# Altium project TMC2590_BOB40_V1_0.PrjPcb
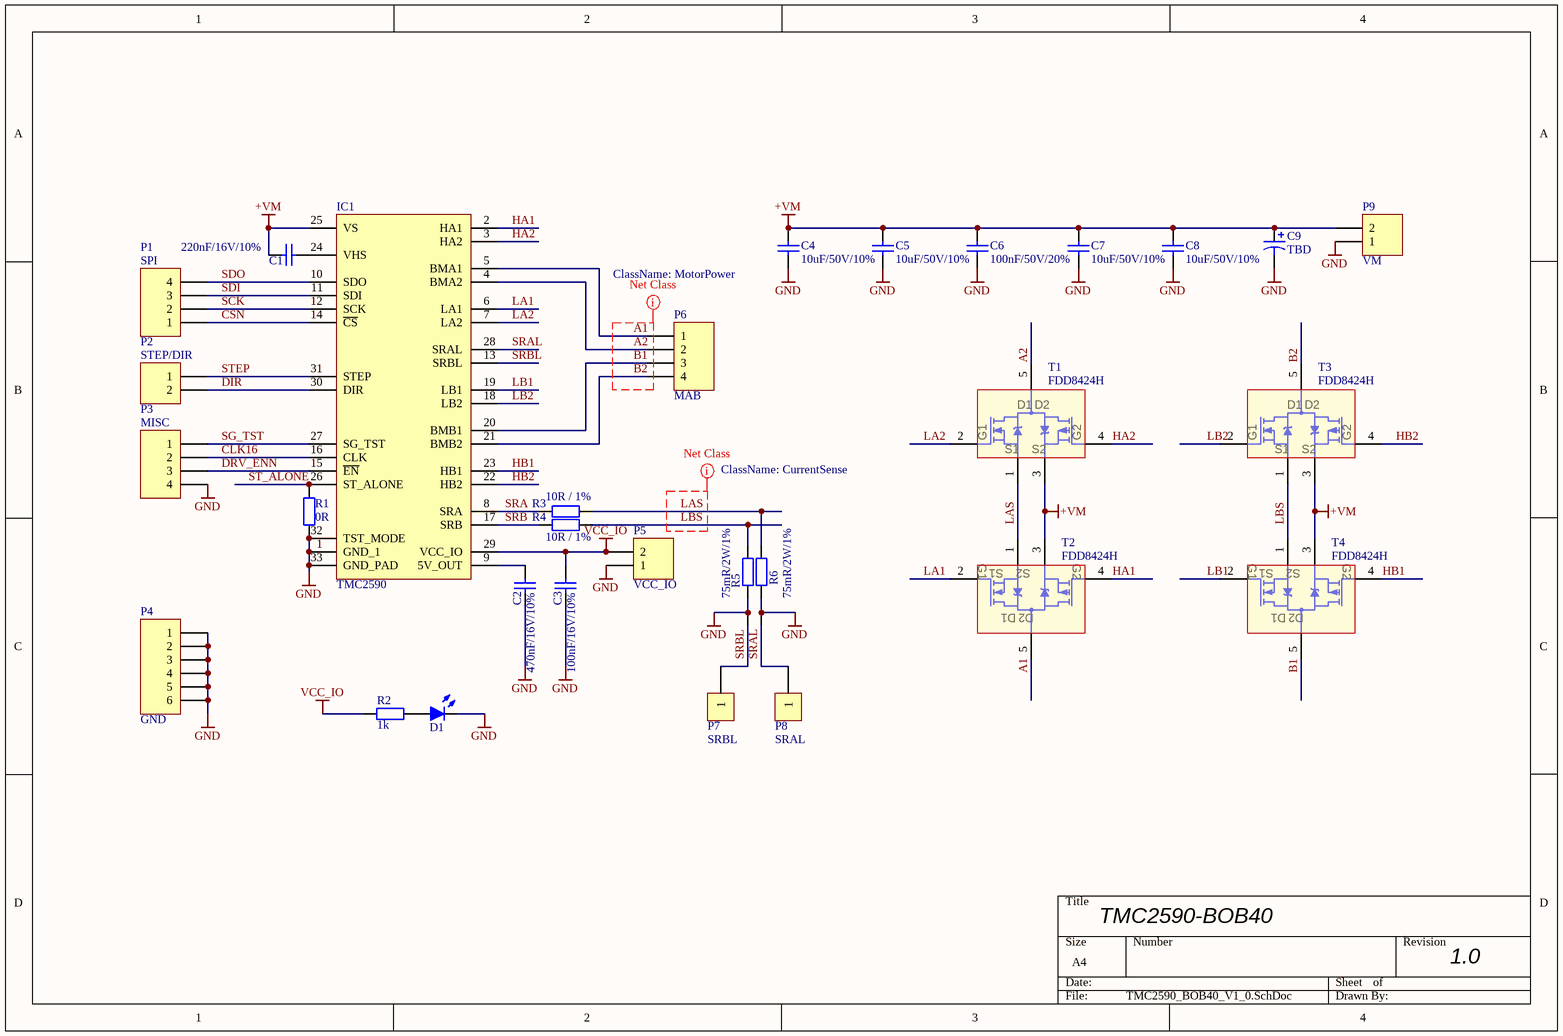
[diagram p0: TMC2590_BOB40_V1_0.SchDoc]
BoardName: TMC2590-BOB40; BoardVersion: 1.0; Chip: TMC2590; IRMS: 2.8A; VS: 9...40V
2 sheets, 32 parts. Net scope: global (net labels, ports and power ports of the same name join across sheets).
Board file: TMC2590_BOB40_V1_0.PcbDoc
Sheets:
  TMC2590_BOB40_V1_0.SchDoc
  ChangeLog.SchDoc

## Sheet TMC2590_BOB40_V1_0.SchDoc
size A4; DocumentNumber: 1; SheetNumber: 1; SheetTotal: 2

### Parts
C1  220nF/16V/10%  [C0603]
C2  470nF/16V/10%  [C0603]
C3  100nF/16V/10%  [C0603]
C4  10uF/50V/10%  [C1206]
C5  10uF/50V/10%  [C1206]
C6  100nF/50V/20%  [C0603]
C7  10uF/50V/10%  [C1206]
C8  10uF/50V/10%  [C1206]
C9  value TBD  [EXT_POL_CAP]  (hidden comment: Cap Pol1)
D1  LED, Blue, SMD, 20mA, 2.8V, 465 nm  [LED_0603]  (value not drawn)
IC1  TMC2590  [TMC2590_QFP127P600-8N]
J1  Net tie  [Net tie 10x20mil]  (value not drawn)  (net tie, no BOM)
J2  Net tie  [Net tie 10x20mil]  (value not drawn)  (net tie, no BOM)
P1  SPI  [4_PIN_THT]
P2  STEP/DIR  [2_PIN_THT]
P3  MISC  [4_PIN_THT]
P4  GND  [6_PIN_THT]
P5  VCC_IO  [2_PIN_THT]
P6  MAB  [4_PIN_THT_1mm_hole]
P7  SRBL  [TH_PIN - NO SILK]
P8  SRAL  [TH_PIN - NO SILK]
P9  VM  [2_PIN_THT]
R1  0R  [R0603]
R2  1k  [R0603]
R3  10R / 1%  [R0603]
R4  10R / 1%  [R0603]
R5  75mR/2W/1%  [R2512]
R6  75mR/2W/1%  [R2512]
T1  FDD8424H  [SOT114P991X239-6N]
T2  FDD8424H  [SOT114P991X239-6N]
T3  FDD8424H  [SOT114P991X239-6N]
T4  FDD8424H  [SOT114P991X239-6N]

### Nets
+VM: C1.2 C4.2 C5.2 C6.2 C7.2 C8.2 C9.1 IC1.25(VS) P9.2 T1.3(S2) T2.3(S2) T3.3(S2) T4.3(S2)
GND: C2.2 C3.2 C4.1 C5.1 C6.1 C7.1 C8.1 C9.2 D1.2(K) IC1.1(GND_1) IC1.32(TST_MODE) IC1.33(GND_PAD) J1.2 J2.2 P3.4 P4.1 P4.2 P4.3 P4.4 P4.5 P4.6 P5.1 P9.1 R1.2 R5.1 R6.1
VCC_IO: C3.1 IC1.29(VCC_IO) P5.2 R2.1
A1: IC1.5(BMA1) P6.1 T2.5(D1/D2)
A2: IC1.4(BMA2) P6.2 T1.5(D1/D2)
B1: IC1.20(BMB1) P6.3 T4.5(D1/D2)
B2: IC1.21(BMB2) P6.4 T3.5(D1/D2)
CLK16: IC1.16(CLK) P3.2
CSN: IC1.14(~{CS}) P1.1
DIR: IC1.30(DIR) P2.2
DRV_ENN: IC1.15(~{EN}) P3.3
HA1: IC1.2(HA1) T2.4(G2)
HA2: IC1.3(HA2) T1.4(G2)
HB1: IC1.23(HB1) T4.4(G2)
HB2: IC1.22(HB2) T3.4(G2)
LA1: IC1.6(LA1) T2.2(G1)
LA2: IC1.7(LA2) T1.2(G1)
LAS: R3.1 R6.2 T1.1(S1) T2.1(S1)
LB1: IC1.19(LB1) T4.2(G1)
LB2: IC1.18(LB2) T3.2(G1)
LBS: R4.1 R5.2 T3.1(S1) T4.1(S1)
SCK: IC1.12(SCK) P1.2
SDI: IC1.11(SDI) P1.3
SDO: IC1.10(SDO) P1.4
SG_TST: IC1.27(SG_TST) P3.1
SRA: IC1.8(SRA) R3.2
SRAL: IC1.28(SRAL) J2.1 P8.1
SRB: IC1.17(SRB) R4.2
SRBL: IC1.13(SRBL) J1.1 P7.1
ST_ALONE: IC1.26(ST_ALONE) R1.1
STEP: IC1.31(STEP) P2.1
NetC1_1: C1.1 IC1.24(VHS)
NetC2_1: C2.1 IC1.9(5V_OUT)
NetD1_1: D1.1(A) R2.2

### Layout directives
net class CurrentSense: LAS, LBS
net class MotorPower: A1, A2, B1, B2

### Notes on the sheet
- Title
- Size:
- Date:
- File:
- A0
- Number:
- Time:
- Revision:
- Sheet
- of
- (in symbol FDD8424H) D1; D2

### Library data of the parts
C1 = Capacitor: Ceramic capacitor; MPN: MC0603B224K160CT; Type: MLCC; VoltageRating: 16V; ComponentLinknDescription: Datasheet; MF: Multicomp; Capacitance: 220nF; Precision: 10%; Characteristic: *; ComponentLinknURL: *
C2 = Capacitor: Ceramic capacitor; MPN: MC0603X474K160CT; Type: MLCC; VoltageRating: 16V; ComponentLinknDescription: Datasheet; MF: Multicomp; Capacitance: 470nF; Precision: 10%; Characteristic: *; ComponentLinknURL: *
C3 = Capacitor: Ceramic capacitor; MPN: MC0603B104K160CT; Type: MLCC; VoltageRating: 16V; ComponentLinknDescription: Datasheet; MF: Multicomp; Capacitance: 100nF; Precision: 10%; Characteristic: *; ComponentLinknURL: *
C4 C5 C7 C8 = 10 µF, 50 V, ± 10%, X5R, 1206 [3216 Metric]: SMD Multilayer Ceramic Capacitor, 1206 [3216 Metric],10 µF, 50 V, ± 10%, X5R, GRM Series; MPN: GRM31CR61H106KA12L; Type: MLCC; VoltageRating: 50V; ComponentLinknDescription: Datasheet; MF: MURATA; Capacitance: 10uF; Characteristic: *; ComponentLinknURL: *; Precision: 10%
C6 = Capacitor: Ceramic capacitor; MPN: MC0603F104M500CT; Type: MLCC; VoltageRating: 50V; ComponentLinknDescription: Datasheet; MF: Multicomp; Capacitance: 100nF; Precision: 20%; Characteristic: *; ComponentLinknURL: *
C9 = Cap Pol1: Polarized Capacitor (Radial); Fitted: Not fitted; Published: 8-Jun-2000; LatestRevisionDate: 17-Jul-2002; LatestRevisionNote: Re-released for DXP Platform.; PackageReference: RB7.6-15; Publisher: Altium Limited; PackageDescription: Polarized Capacitor (Radial); 2 Leads
D1 = LED, Blue, SMD, 20mA, 2.8V, 465 nm: MPN: LTST-C191TBKT-5A; MF: Lite-On; Current rating: 20mA; Colour: Blue
IC1 = TMC2590: Energy saving high resolution microstepping two phase stepper driver with Step/Dir, SPI, up to 60V, TQFP32(5x5); MF: TRINAMIC; MPN: TMC2590
J1 J2 = NET_TIE
P1 P3 = Header 4: Header, 4-Pin; Fitted: Not fitted; LatestRevisionDate: 17-Jul-2002; LatestRevisionNote: Re-released for DXP Platform.; Publisher: Altium Limited; ComponentClass: Pinheader
P2 P5 P9 = Header 2: Header, 2-Pin; Fitted: Not fitted; LatestRevisionDate: 17-Jul-2002; LatestRevisionNote: Re-released for DXP Platform.; Publisher: Altium Limited; ComponentClass: Pinheader
P4 = Header 6: Header, 6-Pin; Fitted: Not fitted; LatestRevisionDate: 17-Jul-2002; LatestRevisionNote: Re-released for DXP Platform.; Publisher: Altium Limited
P6 = Wire-To-Board Connector, 2.5 mm, 4 Contacts, Header, EH Series, Through Hole, 1 Rows: MPN: B4B-EH-A; MF: JST (JAPAN SOLDERLESS TERMINALS); Fitted: Not fitted
P7 P8 = PIN: Note: n.b; Fitted: Not fitted; ComponentClass: Pinheader
R1 = R, 0 ohm, 0603 [1608 Metric], 100 mW, MCWR Series: SMD Chip Resistor, Thick Film, 0 ohm, 0603 [1608 Metric], 100 mW, MCWR Series; MPN: MCWR06X000 PTL; Temp coefficient: *ppm; PowerRating: 100mW; MF: MULTICOMP; Resistance: 0R
R2 = 1 kohm, 50 V, 0603 [1608 Metric], 63 mW, ± 1%, MC Series: MPN: MC0063W060311K; VoltageRating: 50V; Temp coefficient: *ppm; PowerRating: 63mW; MF: MULTICOMP; Precision: 1%; Manufacturer: *; ComponentLinknURL: *; Resistance: 1k
R3 R4 = .05 OHM 2W 1% Current Sense Resistor: SMD Chip Resistor, Thick Film, 10 ohm, 50 V, 0603 [1608 Metric], 100 mW, ± 1%, MCWR Series; MPN: MCWR06X10R0FTL; PowerRating: 100mW; ComponentLinknDescription: Datasheet; MF: Multicomp; Precision: 1%; Manufacturer: *; ComponentLinknURL: *; Resistance: 10R
R5 R6 = .075 OHM 2W 1% Current Sense Resistor: SMD Current Sense Resistor, 0.075 ohm, 2 W, 2512 [6432 Metric], ± 1%, TLR Series; MPN: TLR3A20WR075FTDG; PowerRating: 2W; ComponentLinknDescription: Datasheet; MF: TE CONNECTIVITY; Resistance: 75mR; Precision: 1%; Manufacturer: *; ComponentLinknURL: *
T1-T4 = FDD8424H: Dual MOSFET, N and P Channel, 9 A, 40 V, 0.019 ohm, 10 V, 1.7 V; MF: FAIRCHILD SEMICONDUCTOR; MPN: FDD8424H

## Sheet ChangeLog.SchDoc
size A4; DocumentNumber: 2; SheetNumber: 2; SheetTotal: 2
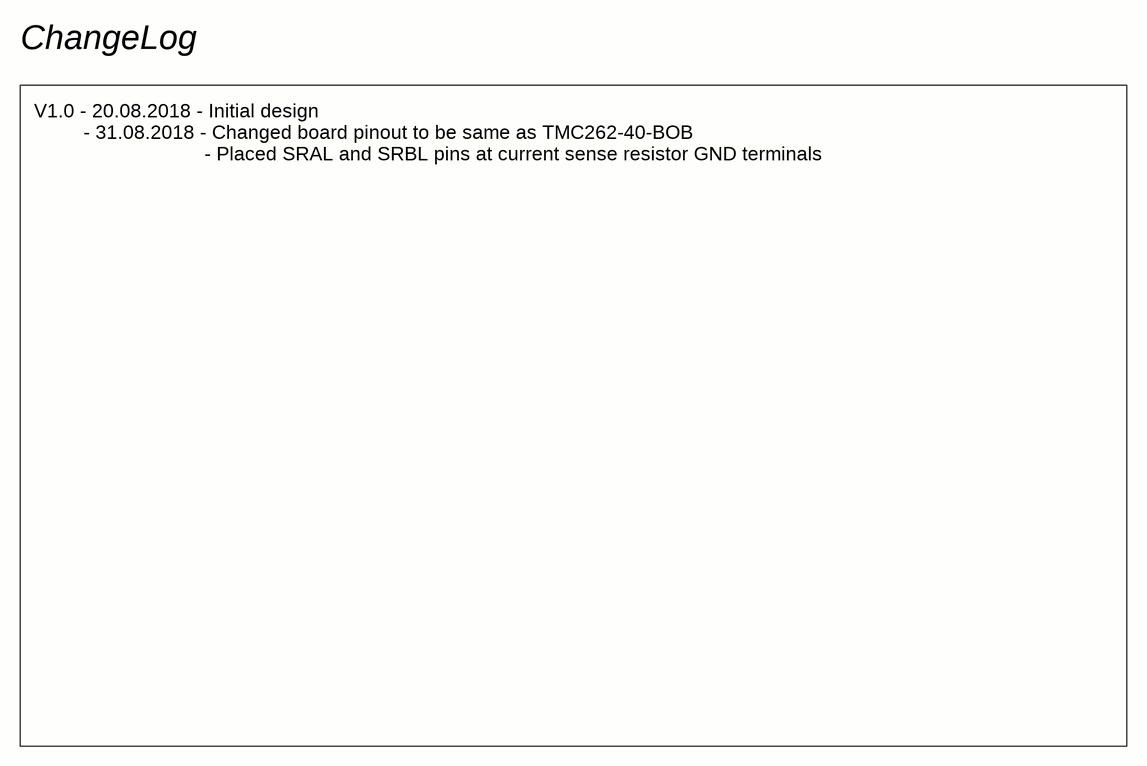
[diagram p1: ChangeLog.SchDoc]

### Notes on the sheet
- ChangeLog
- V1.0 - 20.08.2018 - Initial design
  - 31.08.2018 - Changed board pinout to be same as TMC262-40-BOB
  - Placed SRAL and SRBL pins at current sense resistor GND terminals

## Assembly variants
TMC2590_BOB40_V1_0: not fitted C9 R1